# Altium project PCB_ProjectM24.PrjPcb
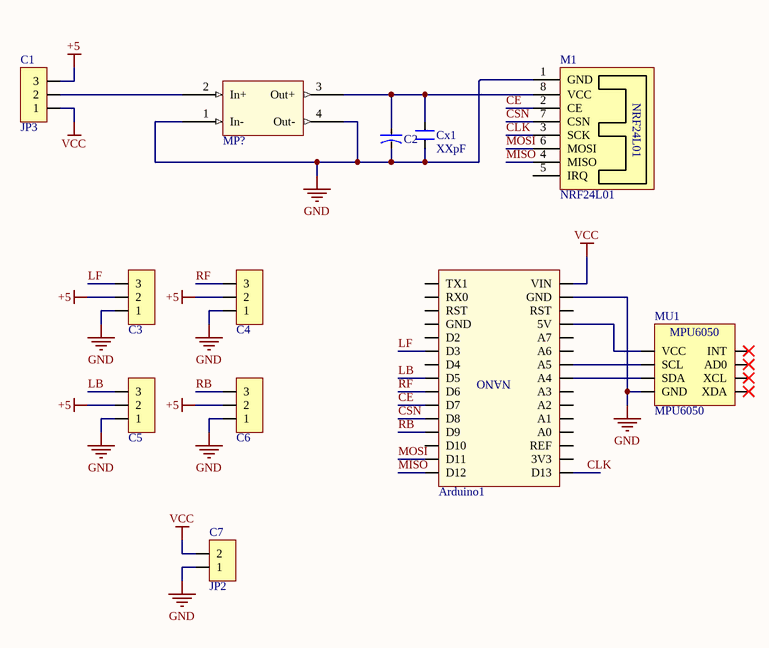
[diagram p0: droneM24.SchDoc]
1 sheet, 12 parts. Net scope: global (net labels, ports and power ports of the same name join across sheets).
Board file: droneM24.PcbDoc

## Sheet droneM24.SchDoc
size A4

### Parts
Arduino1  Arduino Nano  [Arduino Nano]  (value not drawn)
C1  JP3  [JP3-D1T]
C2  CN-ALU-DIP  [CA-ALU-5]  (value not drawn)
C3  JP3  [JP3-C1T]  (value not drawn)
C4  JP3  [JP3-C1T]  (value not drawn)
C5  JP3  [JP3-C1T]  (value not drawn)
C6  JP3  [JP3-C1T]  (value not drawn)
C7  JP2  [JP2-C1T]
Cx1  XXpF  [CN-SMD-1206]
M1  NRF24L01  [NRF24L01]
MP?  MP2307 DC-DC Switching Buck Step-Down Module  [Mini360]  (value not drawn)
MU1  MPU6050  [MPU6050]

### Nets
+5: C1.3 C3.2 C4.2 C5.2 C6.2
GND: Arduino1.GND C2.2 C3.1 C4.1 C5.1 C6.1 C7.1 Cx1.1 M1.1(GND) MP?.1(In-) MP?.4(Out-) MU1.2(GND)
VCC: Arduino1.VIN C1.1 C7.2
CE: Arduino1.D7 M1.2(CE)
CLK: Arduino1.D13 M1.3(SCK)
CSN: Arduino1.D8 M1.7(CSN)
LB: Arduino1.D5 C5.3
LF: Arduino1.D3 C3.3
MISO: Arduino1.D12 M1.4(MISO)
MOSI: Arduino1.D11 M1.6(MOSI)
RB: Arduino1.D9 C6.3
RF: Arduino1.D6 C4.3
NetArduino1_5V: Arduino1.5V MU1.1(VCC)
NetArduino1_A4: Arduino1.A4 MU1.4(SDA)
NetArduino1_A5: Arduino1.A5 MU1.3(SCL)
NetC1_2: C1.2 MP?.2(In+)
NetC2_1: C2.1 Cx1.2 M1.8(VCC) MP?.3(Out+)

Not connected (* = marked no-connect by the designer): Arduino1 3V3 A0 A1 A2 A3 A6 A7 D2 D4 D10 REF RST RX0 TX1; M1 5(IRQ); MU1 5(XDA)* 6(XCL)* 7(AD0)* 8(INT)*

### Notes on the sheet
- (in symbol Arduino Nano) NANO

### Library data of the parts
Arduino1 = Arduino Nano: Value: Cau 1A
C1 C3-C6 = JP3: WR-PHD 2.54 mm Angled Socket Header; Manufacturer: W¨¹rth Elektronik eiSos GmbH; partNo: 613003143121; ComponentLink1 Description: Manufacturer; ComponentLink2 Description: Datasheet; NoPins: 03; Created Date: 29 March 2013; ComponentLink1URL: http://www.we-online.com; ComponentLink2URL: http://katalog.we-online.de/em/datasheet/6130xx143121.pdf; Created by: Karrer Zheng
C2 = CN-ALU-DIP: Capacitor (Semiconductor SIM Model); Value: 104; LatestRevisionDate: 17-Jul-2002; LatestRevisionNote: Re-released for DXP Platform.; PackageReference: C1206; Publisher: Altium Limited
C7 = JP2: WR-PHD 2.54 mm Angled Socket Header; Manufacturer: W¨¹rth Elektronik eiSos GmbH; partNo: 613002143121; ComponentLink1 Description: Manufacturer; ComponentLink2 Description: Datasheet; NoPins: 02; Created Date: 29 March 2013; ComponentLink1URL: http://www.we-online.com; ComponentLink2URL: http://katalog.we-online.de/em/datasheet/6130xx143121.pdf; Created by: Karrer Zheng
Cx1 = CN: Value: 33pF
MP? = MP2307 Module
MU1 = MPU6050: Manufacturer: W¨¹rth Elektronik eiSos GmbH; partNo: 613004143121; ComponentLink1 Description: Manufacturer; ComponentLink2 Description: Datasheet; NoPins: 04; Created Date: 29 March 2013; ComponentLink1URL: http://www.we-online.com; ComponentLink2URL: http://katalog.we-online.de/em/datasheet/6130xx143121.pdf; Created by: Karrer Zheng